# Altium schematic sheet Sheet1.SchDoc
size A
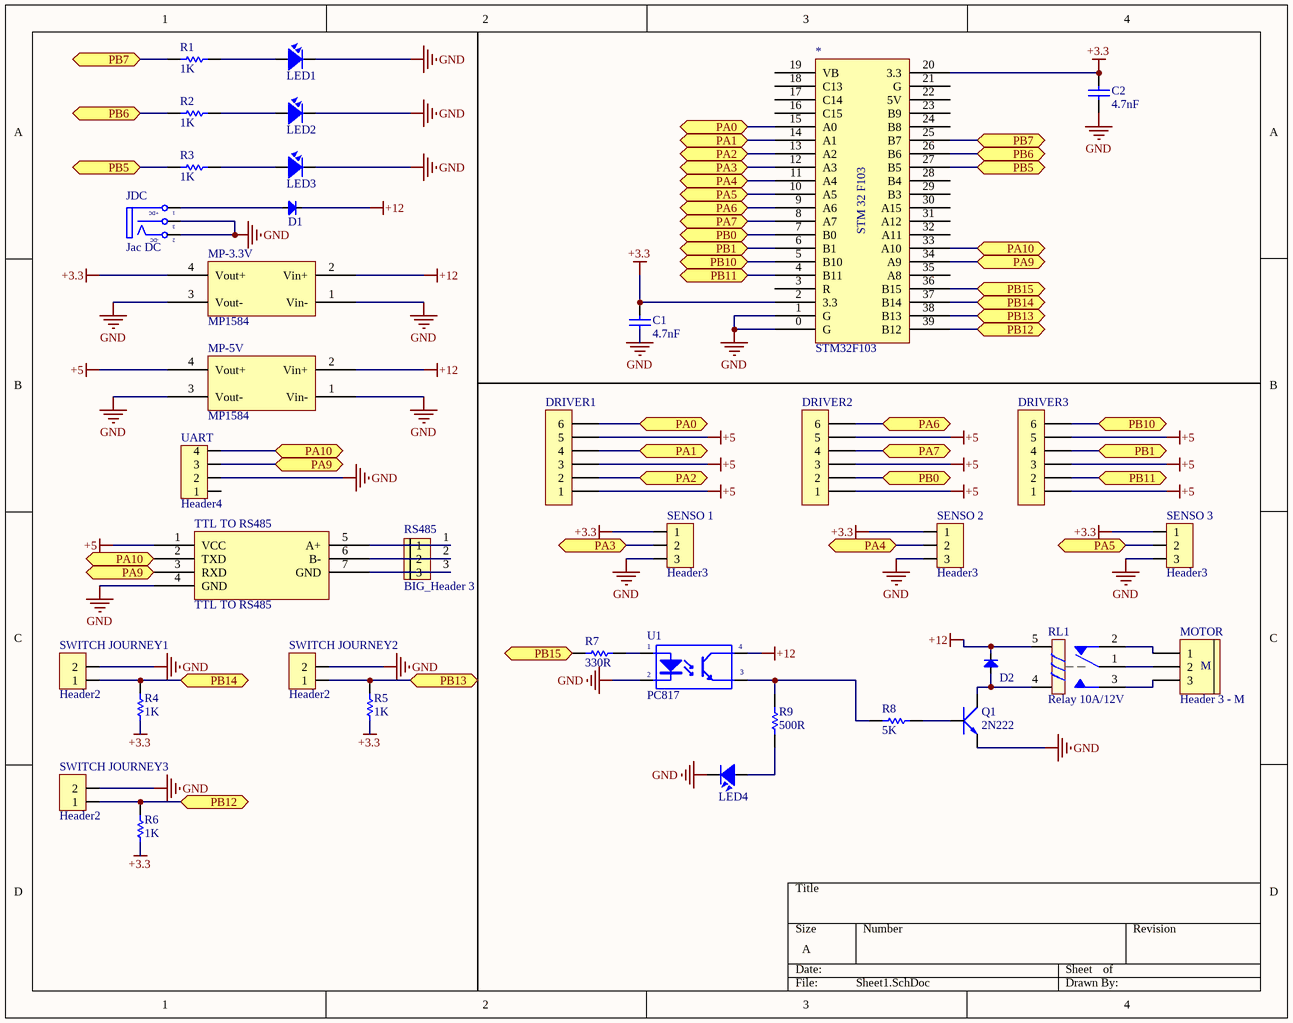
[diagram p0: Sheet1.SchDoc]

## Parts
*  STM32F103  [STM32F103]
C1  4.7nF  [tu 1206]
C2  4.7nF  [tu 1206]
D1  Diode  [DIO-1A]  (value not drawn)
D2  Diode  [DIO-1A]  (value not drawn)
DRIVER1  Header 6P 2.54 Duc Thang  [XH2.54M-6]  (value not drawn)
DRIVER2  Header 6P 2.54 Duc Thang  [XH2.54M-6]  (value not drawn)
DRIVER3  Header 6P 2.54 Duc Thang  [XH2.54M-6]  (value not drawn)
JDC  Jac DC  [DC0]
LED1  LED  [LED-5-Green]  (value not drawn)
LED2  LED  [LED-5-Green]  (value not drawn)
LED3  LED  [LED-5-Green]  (value not drawn)
LED4  LED  [LED-5-Green]  (value not drawn)
MOTOR  Header 3 - M  [Medium - Header 3]
MP-3.3V  MP1584  [MP1584]
MP-5V  MP1584  [MP1584]
Q1  2N222  [TO92-123]
R1  value 1K  [R1/4W1]  (hidden comment: Res1)
R2  value 1K  [R1/4W1]  (hidden comment: Res1)
R3  value 1K  [R1/4W1]  (hidden comment: Res1)
R4  value 1K  [R1/4W1]  (hidden comment: Res1)
R5  value 1K  [R1/4W1]  (hidden comment: Res1)
R6  value 1K  [R1/4W1]  (hidden comment: Res1)
R7  value 330R  [R1/4W1]  (hidden comment: Res1)
R8  value 5K  [R1/4W1]  (hidden comment: Res1)
R9  value 500R  [R1/4W1]  (hidden comment: Res1)
RL1  Relay 10A/12V  [RELAY 5]
RS485  BIG_Header 3  [BIG_Header 3]
SENSO_1  Header3  [Header3]
SENSO_2  Header3  [Header3]
SENSO_3  Header3  [Header3]
SWITCH_JOURNEY1  Header2  [Header2]
SWITCH_JOURNEY2  Header2  [Header2]
SWITCH_JOURNEY3  Header2  [Header2]
TTL_TO_RS485  TTL TO RS485  [TTL TO RS485]
U1  PC817  [DIP4]
UART  Header4  [HDR4]

## Ports
PA0 (bidir), PA1 (bidir), PA2 (bidir), PA3 (bidir), PA4 (bidir), PA5 (bidir), PA6 (bidir), PA7 (bidir), PA9 (bidir), PA10 (bidir), PB0 (bidir), PB1 (bidir), PB5 (bidir), PB6 (bidir), PB7 (bidir), PB10 (bidir), PB11 (bidir), PB12 (bidir), PB13 (bidir), PB14 (bidir), PB15 (bidir)

## Nets
+3.3: *.2(3.3) *.20(3.3) C1.1 C2.1 MP-3.3V.4(Vout+) R4.2 R5.2 R6.2 SENSO_1.1 SENSO_2.1 SENSO_3.1
+5: DRIVER1.1 DRIVER1.3 DRIVER1.5 DRIVER2.1 DRIVER2.3 DRIVER2.5 DRIVER3.1 DRIVER3.3 DRIVER3.5 MP-5V.4(Vout+) TTL_TO_RS485.1(VCC)
+12: D1.2(K) D2.2(K) MP-3.3V.2(Vin+) MP-5V.2(Vin+) RL1.5 U1.4(C)
GND: *.0(G) *.1(G) C1.2 C2.2 JDC.2(TN) JDC.3(S) LED1.2 LED2.2 LED3.2 LED4.2 MP-3.3V.1(Vin-) MP-3.3V.3(Vout-) MP-5V.1(Vin-) MP-5V.3(Vout-) Q1.1(E) SENSO_1.3 SENSO_2.3 SENSO_3.3 SWITCH_JOURNEY1.2 SWITCH_JOURNEY2.2 SWITCH_JOURNEY3.2 TTL_TO_RS485.4(GND) U1.2(K) UART.2
PA0: *.15(A0) DRIVER1.6 ; port PA0
PA1: *.14(A1) DRIVER1.4 ; port PA1
PA2: *.13(A2) DRIVER1.2 ; port PA2
PA3: *.12(A3) SENSO_1.2 ; port PA3
PA4: *.11(A4) SENSO_2.2 ; port PA4
PA5: *.10(A5) SENSO_3.2 ; port PA5
PA6: *.9(A6) DRIVER2.6 ; port PA6
PA7: *.8(A7) DRIVER2.4 ; port PA7
PA9: *.34(A9) TTL_TO_RS485.3(RXD) UART.3 ; port PA9
PA10: *.33(A10) TTL_TO_RS485.2(TXD) UART.4 ; port PA10
PB0: *.7(B0) DRIVER2.2 ; port PB0
PB1: *.6(B1) DRIVER3.4 ; port PB1
PB5: *.27(B5) R3.2 ; port PB5
PB6: *.26(B6) R2.2 ; port PB6
PB7: *.25(B7) R1.2 ; port PB7
PB10: *.5(B10) DRIVER3.6 ; port PB10
PB11: *.4(B11) DRIVER3.2 ; port PB11
PB12: *.39(B12) R6.1 SWITCH_JOURNEY3.1 ; port PB12
PB13: *.38(B13) R5.1 SWITCH_JOURNEY2.1 ; port PB13
PB14: *.37(B14) R4.1 SWITCH_JOURNEY1.1 ; port PB14
PB15: *.36(B15) R7.1 ; port PB15
NetD1_1: D1.1(A) JDC.1(T)
NetD2_1: D2.1(A) Q1.3(C) RL1.4
NetLED1_1: LED1.1 R1.1
NetLED2_1: LED2.1 R2.1
NetLED3_1: LED3.1 R3.1
NetLED4_1: LED4.1 R9.2
NetMOTOR_1: MOTOR.1 RL1.2
NetMOTOR_2: MOTOR.2 RL1.1
NetMOTOR_3: MOTOR.3 RL1.3
NetQ1_2: Q1.2(B) R8.2
NetR7_2: R7.2 U1.1(A)
NetR8_1: R8.1 R9.1 U1.3(E)
NetRS485_1: RS485.1 TTL_TO_RS485.5(A+)
NetRS485_2: RS485.2 TTL_TO_RS485.6(B-)
NetRS485_3: RS485.3 TTL_TO_RS485.7(GND)

Not connected (* = marked no-connect by the designer): * 3(R) 16(C15) 17(C14) 18(C13) 19(VB) 21(G) 22(5V) 23(B9) 24(B8) 28(B4) 29(B3) 30(A15) 31(A12) 32(A11) 35(A8); UART 1

## Notes on the sheet
- (in symbol DCIN) +DC; -DC
- (in symbol Header 3 - M) M
- (in symbol STM32F103) STM 32 F103

## Library data of the parts
C1 C2 = Tu 1206 4.7nF 50V: Dán; Don_Vi: Con; So_Chan: 2; Ten_Linh_Kien: Tụ 1206 4.7nF 50V NPO; Ma_Hang: MH007538; Chung_Loai: Dán; Kieu_Chan: *
D1 D2 = Diode: Default Diode; Code - JEDEC: DO-214-AB; Value: 1N5007; Published: 8-Jun-2000; Revision: July-2002: Re-released for DXP Platform.; Publisher: Altium Limited
DRIVER1-DRIVER3 = Header 6P 2.54 Duc Thang: Cắm; Ten_Linh_Kien: Header 6P XH2.54-6P Đực Thẳng; Don_Vi: Con; Ma_Hang: MH001972; Chung_Loai: Cắm
JDC = DCIN: Jac DC input; Value: Jac DC
LED1-LED4 = LED: LED Single colour Green and Red; Value: LED 3 ly Single Colour
MOTOR = Header 3 - M: Header, 3-Pin, Medium; LatestRevisionDate: 17-Jul-2002; LatestRevisionNote: Re-released for DXP Platform.; Publisher: Altium Limited
Q1 = 2N222: NPN 600mW, ECB; Value: C1815
R1-R9 = Res1_2: Resistor; Manufacturer: Generic Components; Class: Passive; Published: 08/06/2000; Publisher: Altium Hobart Technology Centre; SubClass: Resistor
RL1 = Relay 5: Relay SPDT,10A - 12VDC 5 Pin; Value: Relay SPDT, 10A, 12V
SENSO_1-SENSO_3 = Header3: Header IDC, 3 x 1 Pin Vertical 2.54mm Pitch (Non-Boxed, Male); Manufacturer: W¨¹rth Elektronik eiSos GmbH; partNo: 613002143121; ComponentLink1 Description: Manufacturer; ComponentLink2 Description: Datasheet; NoPins: 02; Created Date: 29 March 2013; ComponentLink1URL: http://www.we-online.com; ComponentLink2URL: http://katalog.we-online.de/em/datasheet/6130xx143121.pdf; Created by: Karrer Zheng
SWITCH_JOURNEY1-SWITCH_JOURNEY3 = Header2: Header IDC, 2 x 1 Pin Vertical 2.54mm Pitch (Non-Boxed, Male); Manufacturer: W¨¹rth Elektronik eiSos GmbH; partNo: 613002143121; ComponentLink1 Description: Manufacturer; ComponentLink2 Description: Datasheet; NoPins: 02; Created Date: 29 March 2013; ComponentLink1URL: http://www.we-online.com; ComponentLink2URL: http://katalog.we-online.de/em/datasheet/6130xx143121.pdf; Created by: Karrer Zheng
U1 = PC817: Single Opto; Value: PC817
UART = Header4: Header IDC, 4 x 1 Pin Vertical 2.54mm Pitch (Non-Boxed, Male); Manufacturer: W¨¹rth Elektronik eiSos GmbH; partNo: 613002143121; ComponentLink1 Description: Manufacturer; ComponentLink2 Description: Datasheet; NoPins: 02; Created Date: 29 March 2013; ComponentLink1URL: http://www.we-online.com; ComponentLink2URL: http://katalog.we-online.de/em/datasheet/6130xx143121.pdf; Created by: Karrer Zheng